# Altium project Circuit.PrjPcb
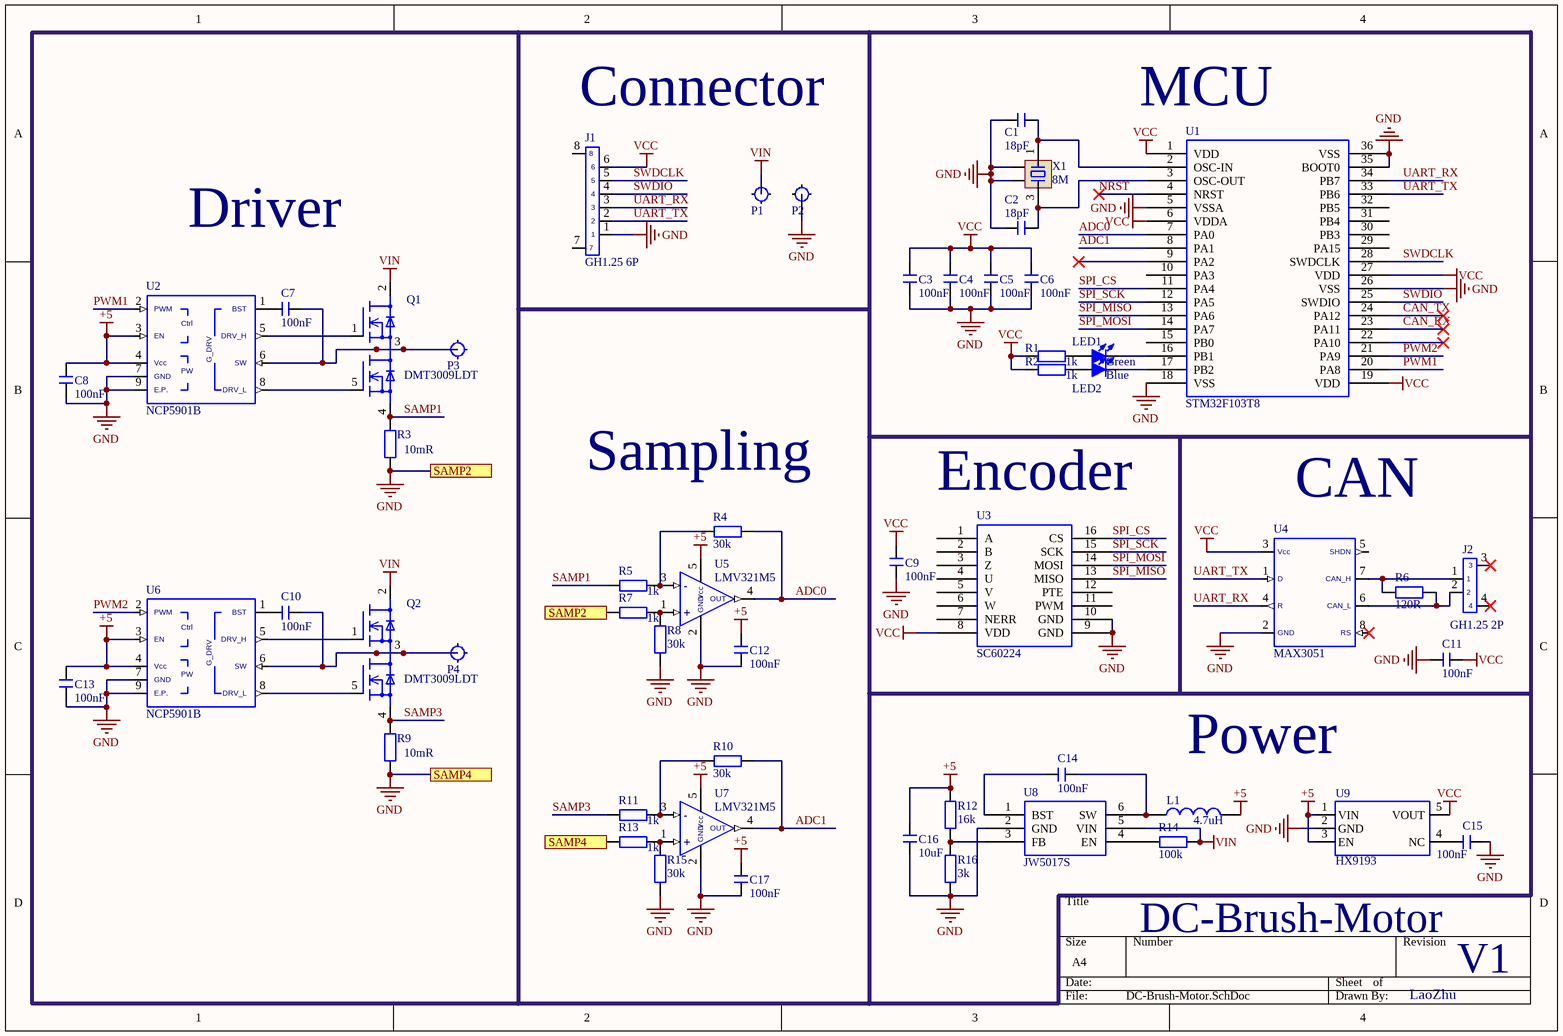
[diagram p0: DC-Brush-Motor.SchDoc]
1 sheet, 54 parts. Net scope: flat (ports and power ports of the same name join across sheets).
Board file: DC_Brush-Motor-V1.PcbDoc

## Sheet DC-Brush-Motor.SchDoc
size A4

### Parts
C1  value 18pF  [C 0603]  (hidden comment: C)
C2  value 18pF  [C 0603]  (hidden comment: C)
C3  value 100nF  [C 0603]  (hidden comment: C)
C4  value 100nF  [C 0603]  (hidden comment: C)
C5  value 100nF  [C 0603]  (hidden comment: C)
C6  value 100nF  [C 0603]  (hidden comment: C)
C7  value 100nF  [C 0603]  (hidden comment: C)
C8  value 100nF  [C 0603]  (hidden comment: C)
C9  value 100nF  [C 0603]  (hidden comment: C)
C10  value 100nF  [C 0603]  (hidden comment: C)
C11  value 100nF  [C 0603]  (hidden comment: C)
C12  value 100nF  [C 0603]  (hidden comment: C)
C13  value 100nF  [C 0603]  (hidden comment: C)
C14  value 100nF  [C 0603]  (hidden comment: C)
C15  value 100nF  [C 0603]  (hidden comment: C)
C16  value 10uF  [C 0603]  (hidden comment: C)
C17  value 100nF  [C 0603]  (hidden comment: C)
J1  GH1.25 6P  [GH1.25-6P]
J2  GH1.25 2P  [GH1.25-2P]
L1  value 4.7uH  [M2520L]  (hidden comment: L)
LED1  Green  [LED 0603W]
LED2  Blue  [LED 0603W]
P1  CON_Single  [SIG_PAD]  (value not drawn)
P2  CON_Single  [SIG_PAD]  (value not drawn)
P3  CON_Single  [4.8MM 冷压端子]  (value not drawn)
P4  CON_Single  [4.8MM 冷压端子]  (value not drawn)
Q1  DMT3009LDT  [DFN-8 3X3 (TYPE-K)]
Q2  DMT3009LDT  [DFN-8 3X3 (TYPE-K)]
R1  value 1k  [R 0603]  (hidden comment: R)
R2  value 1k  [R 0603]  (hidden comment: R)
R3  value 10mR  [R 1206-HP]  (hidden comment: R)
R4  value 30k  [R 0603]  (hidden comment: R)
R5  value 1k  [R 0603]  (hidden comment: R)
R6  value 120R  [R 0603]  (hidden comment: R)
R7  value 1k  [R 0603]  (hidden comment: R)
R8  value 30k  [R 0603]  (hidden comment: R)
R9  value 10mR  [R 1206-HP]  (hidden comment: R)
R10  value 30k  [R 0603]  (hidden comment: R)
R11  value 1k  [R 0603]  (hidden comment: R)
R12  value 16k  [R 0603]  (hidden comment: R)
R13  value 1k  [R 0603]  (hidden comment: R)
R14  value 100k  [R 0603]  (hidden comment: R)
R15  value 30k  [R 0603]  (hidden comment: R)
R16  value 3k  [R 0603]  (hidden comment: R)
U1  STM32F103T8  [QFN-36]
U2  NCP5901B  [DFN-8]
U3  SC60224  [SSOP16]
U4  MAX3051  [SOT23-8L]
U5  LMV321M5  [SOT23-5L]
U6  NCP5901B  [DFN-8]
U7  LMV321M5  [SOT23-5N]
U8  JW5017S  [SOT23-6L]
U9  HX9193  [SOT23-5L]
X1  8M  [XTAL-3225]

### Ports
SAMP2, SAMP4

### Nets
+5: C8.2 C12.2 C13.2 C16.1 C17.2 L1.2 R12.1 U2.3(EN) U2.4(Vcc) U5.5(Vcc) U6.3(EN) U6.4(Vcc) U7.5(Vcc) U9.1(VIN) U9.3(EN)
GND: C1.1 C2.1 C3.1 C4.1 C5.1 C6.1 C8.1 C9.1 C11.1 C12.1 C13.1 C15.2 C16.2 C17.1 J1.1 P2.0 R3.2 R7.1 R8.1 R9.2 R13.1 R15.1 R16.1 U1.5(VSSA) U1.18(VSS) U1.26(VSS) U1.35(BOOT0) U1.36(VSS) U2.7(GND) U2.9(E.P.) U3.9(GND) U3.10(GND) U4.2(GND) U5.2(GND) U6.7(GND) U6.9(E.P.) U7.2(GND) U8.2(GND) U9.2(GND) X1.2 X1.4 ; port SAMP2, port SAMP4
VCC: C3.2 C4.2 C5.2 C6.2 C9.2 C11.2 J1.6 R1.1 R2.1 U1.1(VDD) U1.6(VDDA) U1.19(VDD) U1.27(VDD) U3.8(VDD) U4.3(Vcc) U9.5(VOUT)
VIN: P1.0 Q1.2(D1) Q2.2(D1) R14.2 U8.5(VIN)
ADC0: R4.2 U1.7(PA0) U5.4(OUT)
ADC1: R10.2 U1.8(PA1) U7.4(OUT)
CAN_RX: U1.23(PA11)
CAN_TX: U1.24(PA12)
NRST: U1.4(NRST)
PWM1: U1.20(PA8) U2.2(PWM)
PWM2: U1.21(PA9) U6.2(PWM)
SAMP1: Q1.4(S2) R3.1 R5.1
SAMP3: Q2.4(S2) R9.1 R11.1
SPI_CS: U1.11(PA4) U3.16(CS)
SPI_MISO: U1.13(PA6) U3.13(MISO)
SPI_MOSI: U1.14(PA7) U3.14(MOSI)
SPI_SCK: U1.12(PA5) U3.15(SCK)
SWDCLK: J1.5 U1.28(SWDCLK)
SWDIO: J1.4 U1.25(SWDIO)
UART_RX: J1.3 U1.34(PB7) U4.4(R)
UART_TX: J1.2 U1.33(PB6) U4.1(D)
NetC1_2: C1.2 U1.2(OSC-IN) X1.1
NetC2_2: C2.2 U1.3(OSC-OUT) X1.3
NetC7_1: C7.1 U2.1(BST)
NetC7_2: C7.2 P3.0 Q1.3(S1/D2) U2.6(SW)
NetC10_1: C10.1 U6.1(BST)
NetC10_2: C10.2 P4.0 Q2.3(S1/D2) U6.6(SW)
NetC14_1: C14.1 L1.1 U8.6(SW)
NetC14_2: C14.2 U8.1(BST)
NetC15_1: C15.1 U9.4(NC)
NetJ2_1: J2.1 R6.1 U4.7(CAN_H)
NetJ2_2: J2.2 R6.2 U4.6(CAN_L)
NetLED1_1: LED1.1(A) R1.2
NetLED1_2: LED1.2(K) U1.16(PB1)
NetLED2_1: LED2.1(A) R2.2
NetLED2_2: LED2.2(K) U1.17(PB2)
NetQ1_1: Q1.1(G1) U2.5(DRV_H)
NetQ1_5: Q1.5(G2) U2.8(DRV_L)
NetQ2_1: Q2.1(G1) U6.5(DRV_H)
NetQ2_5: Q2.5(G2) U6.8(DRV_L)
NetR4_1: R4.1 R5.2 U5.3(-)
NetR7_2: R7.2 R8.2 U5.1(+)
NetR10_1: R10.1 R11.2 U7.3(-)
NetR12_2: R12.2 R16.2 U8.3(FB)
NetR13_2: R13.2 R15.2 U7.1(+)
NetR14_1: R14.1 U8.4(EN)

Not connected (* = marked no-connect by the designer): J1 7 8; J2 3* 4*; U1 9(PA2)* 10(PA3) 15(PB0) 22(PA10)* 29(PA15) 30(PB3) 31(PB4) 32(PB5); U3 1(A) 2(B) 3(Z) 4(U) 5(V) 6(W) 7(NERR) 11(PWM) 12(PTE); U4 5(SHDN) 8(RS)*

### Notes on the sheet
- (near J1) Connector
- (near U1) MCU
- Driver
- (near R4) Sampling
- (near U3) Encoder
- CAN
- Power
- DC-Brush-Motor
- V1
- LaoZhu
- (in symbol U_FETs_DVR) Ctrl; G_DRV; PW

### Library data of the parts
C1-C17 = C: 无极性贴片电容
J1 = CON_GH1.25_6P: ComponentLink1Description: Materials' link; ComponentLink1URL: https://item.szlcsc.com/363978.html
J2 = CON_GH1.25_2P: ComponentLink1Description: Materials' link; ComponentLink1URL: https://item.szlcsc.com/363977.html
L1 = L: 小功率贴片电感
LED1 LED2 = LED-SMD: 贴片LED; 版权归属: 源创客; BOM名称: 贴片LED; 学习资源: www.ooocke.com
Q1 Q2 = Q_FET_Nx2
R1-R16 = R: 贴片电阻
U2 U6 = U_FETs_DVR
U4 = U_CAN_TRANS#1: ComponentLink1Description: Materials' link; ComponentLink1URL: https://item.szlcsc.com/113237.html
U5 U7 = U_AMP
U9 = HX9193: Buck降压芯片
X1 = XTAL-4: 4脚晶振; 版权归属: 源创客; BOM名称: 4脚晶振; 学习资源: www.ooocke.com